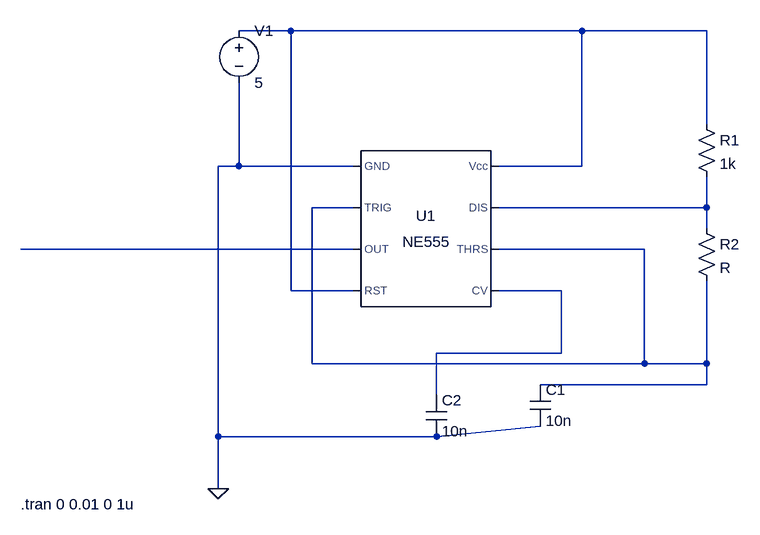
[diagram p0: schematic 2.asc]
2.asc, the LTspice schematic file:
Version 4
SHEET 1 880 680
WIRE -32 -112 -112 -112
WIRE 416 -112 -32 -112
WIRE 608 -112 416 -112
WIRE 608 32 608 -112
WIRE -112 96 -112 -32
WIRE -112 96 -144 96
WIRE 64 96 -112 96
WIRE 416 96 416 -112
WIRE 416 96 288 96
WIRE 64 160 0 160
WIRE 608 160 608 112
WIRE 608 160 288 160
WIRE 608 192 608 160
WIRE 64 224 -448 224
WIRE 512 224 288 224
WIRE -32 288 -32 -112
WIRE 64 288 -32 288
WIRE 384 288 288 288
WIRE 384 384 384 288
WIRE 384 384 192 384
WIRE 0 400 0 160
WIRE 512 400 512 224
WIRE 512 400 0 400
WIRE 608 400 608 272
WIRE 608 400 512 400
WIRE 608 432 608 400
WIRE 608 432 352 432
WIRE 192 448 192 384
WIRE -144 512 -144 96
WIRE 192 512 352 496
WIRE 192 512 -144 512
WIRE -144 592 -144 512
FLAG -144 592 0
SYMBOL Misc\\NE555 176 192 R0
SYMATTR InstName U1
SYMBOL voltage -112 -128 R0
WINDOW 123 0 0 Left 0
WINDOW 39 0 0 Left 0
SYMATTR InstName V1
SYMATTR Value 5
SYMBOL cap 336 432 R0
SYMATTR InstName C1
SYMATTR Value 10n
SYMBOL cap 176 448 R0
SYMATTR InstName C2
SYMATTR Value 10n
SYMBOL res 592 16 R0
SYMATTR InstName R1
SYMATTR Value 1k
SYMBOL res 592 176 R0
SYMATTR InstName R2
TEXT -448 616 Left 2 !.tran 0 0.01 0 1u

The netlist it stands for:
* 2.asc
XU1 0 N002 N004 N001 N005 N002 N003 N001 NE555  ; pins GND TRIG OUT RST CV THRS DIS Vcc
V1 N001 0 5
C1 N002 0 10n
C2 N005 0 10n
R1 N001 N003 1k
R2 N003 N002 R
.tran 0 0.01 0 1u
.lib NE555.sub
.backanno
.end